# Altium schematic sheet SD&UART&Sensor.SchDoc
size A4
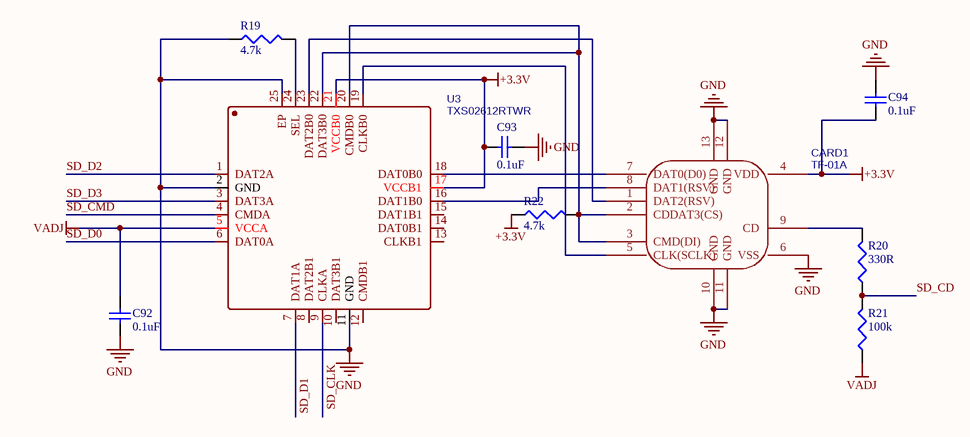
[diagram p0: SD&UART&Sensor.SchDoc]

## Parts
C92  value 0.1uF  [0402]  (hidden comment: Cap Semi)
C93  value 0.1uF  [0402]  (hidden comment: Cap Semi)
C94  value 0.1uF  [0402]  (hidden comment: Cap Semi)
CARD1  TF-01A  [MICRO_SD]
R19  value 4.7k  [J1-0603]  (hidden comment: Res3)
R20  value 330R  [J1-0603]  (hidden comment: Res3)
R21  value 100k  [J1-0603]  (hidden comment: Res3)
R22  value 4.7k  [J1-0603]  (hidden comment: Res3)
U3  TXS02612RTWR  [QFN24_RTW]

## Nets
+3.3V: C93.2 C94.1 CARD1.4(VDD) R22.1 U3.17(VCCB1) U3.21(VCCB0)
GND: C92.1 C93.1 C94.2 CARD1.6(VSS) CARD1.10(GND) CARD1.11(GND) CARD1.12(GND) CARD1.13(GND) R19.1 U3.2(GND) U3.11(GND) U3.25(EP)
VADJ: C92.2 R21.1 U3.5(VCCA)
SD_CD: R20.1 R21.2
SD_CLK: U3.9(CLKA)
SD_CMD: U3.4(CMDA)
SD_D0: U3.6(DAT0A)
SD_D1: U3.7(DAT1A)
SD_D2: U3.1(DAT2A)
SD_D3: U3.3(DAT3A)
NetCARD1_1: CARD1.1(DAT2(RSV)) U3.23(DAT2B0)
NetCARD1_2: CARD1.2(CDDAT3(CS)) CARD1.3(CMD(DI)) R22.2 U3.20(CMDB0) U3.22(DAT3B0)
NetCARD1_5: CARD1.5(CLK(SCLK)) U3.19(CLKB0)
NetCARD1_7: CARD1.7(DAT0(D0)) U3.18(DAT0B0)
NetCARD1_8: CARD1.8(DAT1(RSV)) U3.16(DAT1B0)
NetCARD1_9: CARD1.9(CD) R20.2
NetR19_2: R19.2 U3.24(SEL)

Not connected (* = marked no-connect by the designer): U3 8(DAT2B1) 10(DAT3B1) 12(CMDB1) 13(CLKB1) 14(DAT0B1) 15(DAT1B1)

## Library data of the parts
C92-C94 = Cap Semi: Capacitor (Semiconductor SIM Model); Published: 8-Jun-2000; LatestRevisionDate: 29-May-2009; LatestRevisionNote: IPC-7351 Footprint Added.; PackageReference: C1206; Publisher: Altium Limited; PackageDescription: Chip Capacitor
CARD1 = TF-01A: BOM_Manufacturer: HRO; BOM_Supplier: LCSC; BOM_Manufacturer Part: TF-01A; BOM_Supplier Part: C91145; spicePre: C; spiceSymbolName: TF-01A
R19-R22 = Res3: Resistor; Published: 8-Jun-2000; LatestRevisionDate: 29-May-2009; LatestRevisionNote: IPC-7351 Footprint Added.; PackageReference: J1-0603; Publisher: Altium Limited; PackageDescription: Chip Resistor
U3 = TXS02612RTWR: BOM_Manufacturer: Texas Instruments; Contributor: LCSC; BOM_Supplier: LCSC; BOM_Supplier Part: C140276; BOM_Manufacturer Part: TXS02612RTWR; spicePre: U; spiceSymbolName: TXS02612RTWR